# EAGLE schematic Protocell_module (EAGLE 7.1.0)
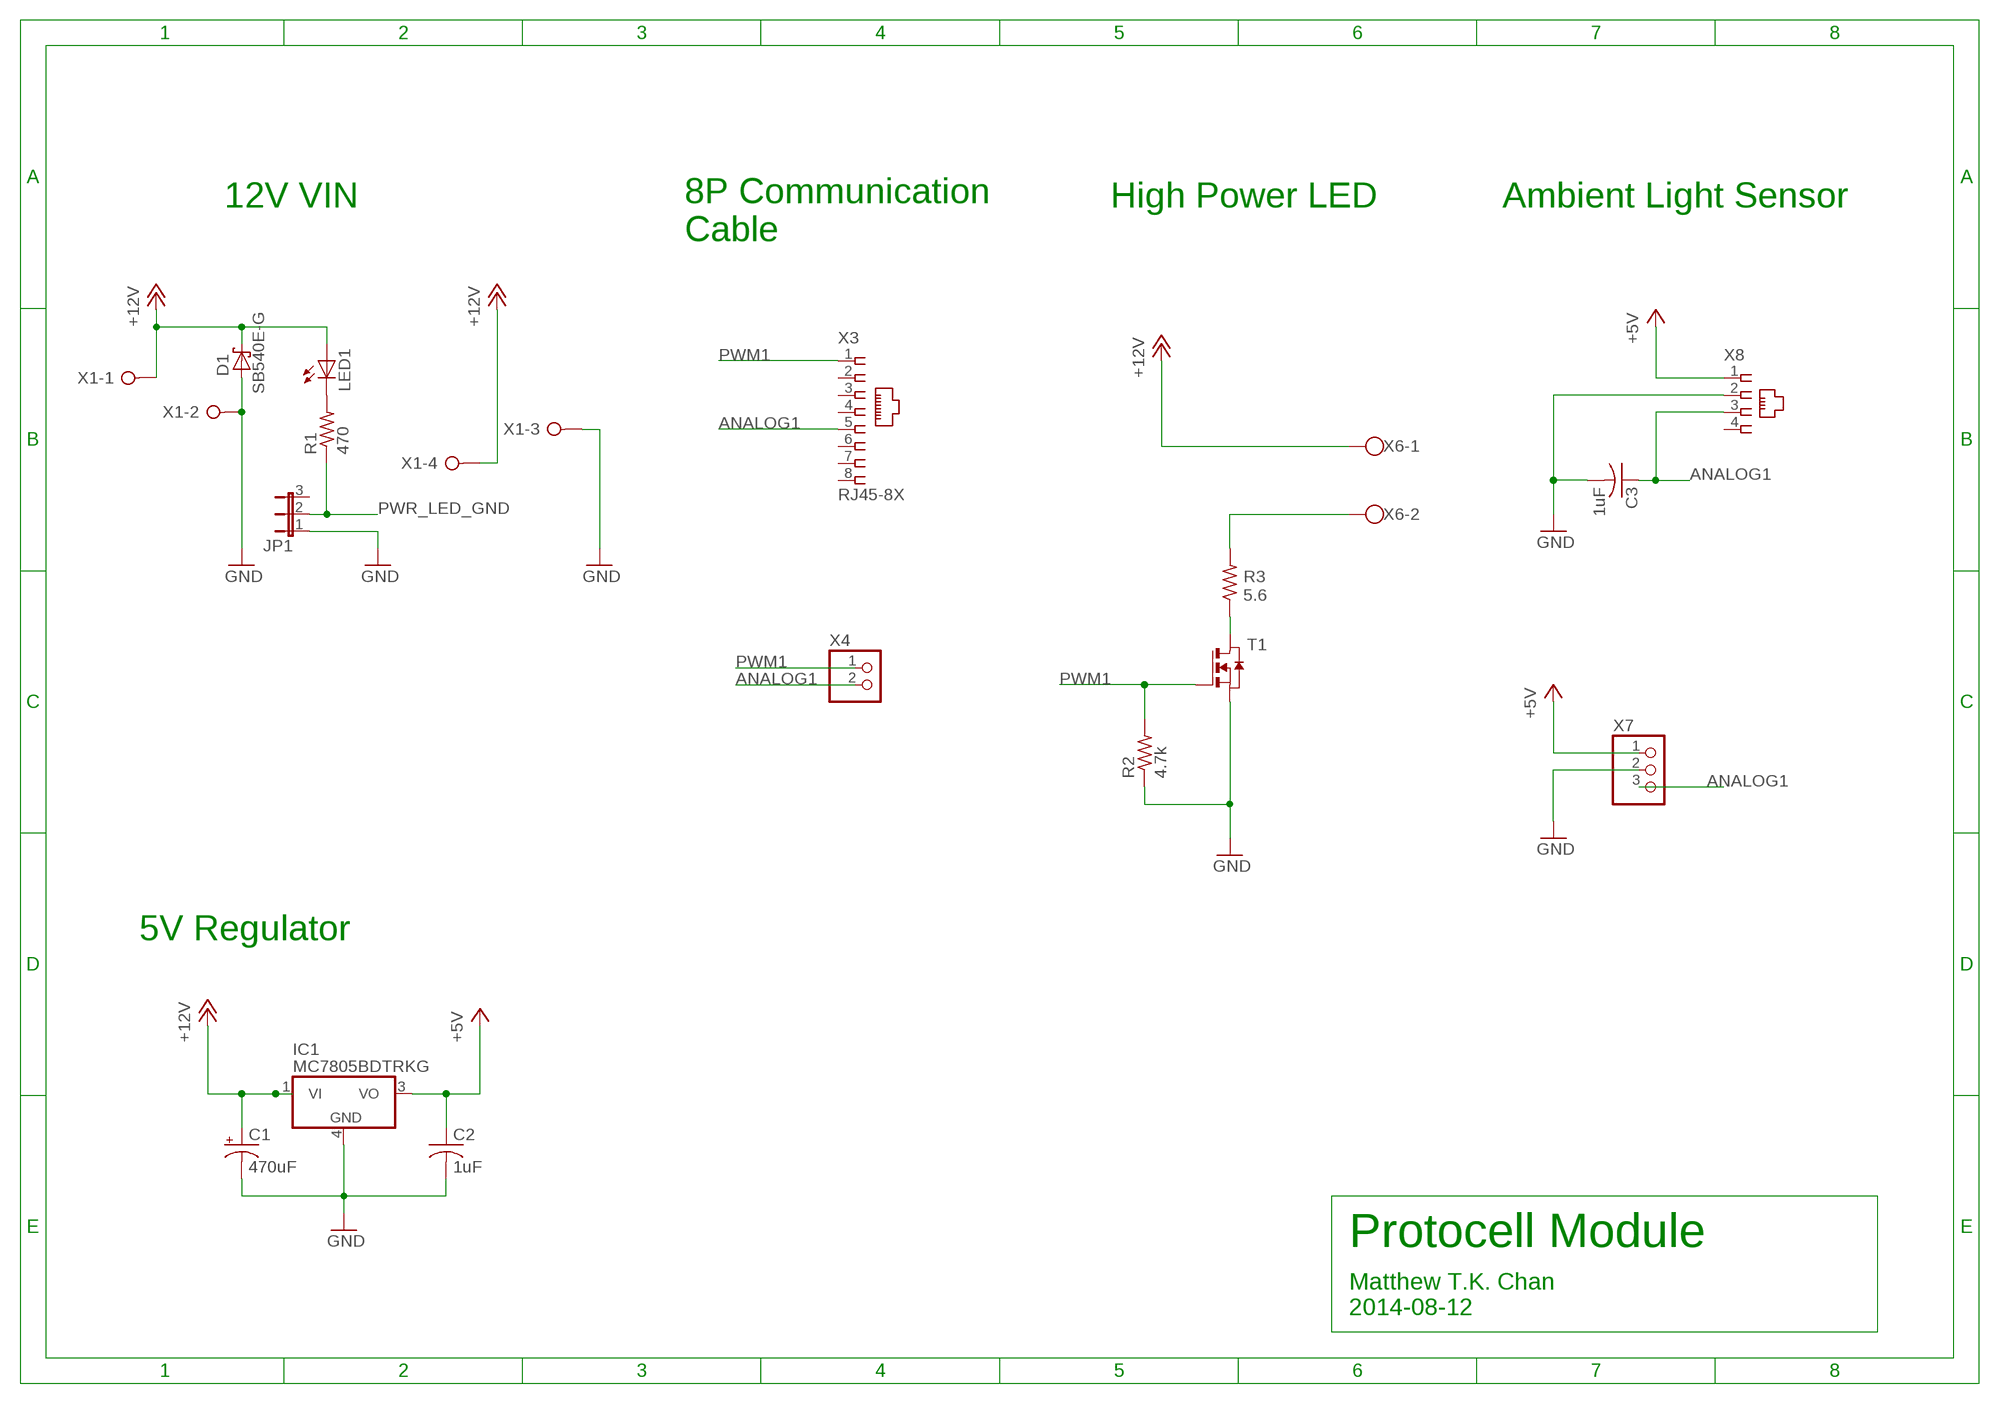
[diagram p0: schematic, sheet 1]

## Parts
C1  470uF  CPOL-USE5-10.5  [E5-10,5]
C2  1uF  C-USC0603  [C0603]
C3  1uF  C-USC0603  [C0603]
D1  SB540E-G  [DO201T15]
IC1  MC7805BDTRKG  [DPACK_3]
JP1  JP2E  [JP2]
LED1  LEDSML1206  [SML1206]
R1  470  R-US_R0603  [R0603]
R2  4.7k  R-US_R0603  [R0603]
R3  5.6  SQP500JB-5R6  [YAGEO_SQP500JB]
T1  NTD5867NLT4G  [DPACK]
X1  W237-04P  [W237-4P]
X3  RJ45-8X  [RJ45-NO-SHIELD]
X4  PINHD-1X2  [1X02]
X6  W237-102  [W237-102]
X7  PINHD-1X3  [1X03]
X8  558872-1  [558872-1]

## Nets
+5V: C2.1 IC1.3(VO) X7.1 X8.1
+12V: C1.+ D1.C IC1.1(VI) LED1.A X1.1 X1.4 X6.1
ANALOG1: C3.1 X3.5 X4.2 X7.3 X8.3
GND: C1.- C2.2 C3.2 D1.A IC1.4(GND) JP1.1 R2.1 T1.3(S) X1.2 X1.3 X7.2 X8.2
N$1: R3.1 T1.2(D)
N$3: R3.2 X6.2
N$10: LED1.C R1.2
PWM1: R2.2 T1.1(G) X3.1 X4.1
PWR_LED_GND: JP1.2 R1.1
Unconnected: JP1.3 X3.2 X3.3 X3.4 X3.6 X3.7 X3.8 X8.4

## Notes on the sheet
- 12V VIN | High Power LED | Ambient Light Sensor
- 8P Communication 
  Cable
- 5V Regulator
- Protocell Module
- Matthew T.K. Chan
  2014-08-12

## Library data of the parts
C1 = rcl:CPOL-US: POLARIZED CAPACITOR, American symbol
C2 C3 = rcl:C-US: CAPACITOR, American symbol
D1 = CBLA_Test_bed_Library:SB540E-G: SCHOTTKY BARRIER RECTIFIER 3.0 AMPERES 20, 30, 40 VOLT Source: MBRS340T3-D.pdf
IC1 = CBLA_Test_bed_Library:MC78: 1A Positive Voltage Regulators Source: Data sheet <http://www.onsemi.com/pub_link/Collateral/MC7800-D.PDF>
JP1 = jumper:JP2E: JUMPER
LED1 = led:LED: LED OSRAM: - CHIPLED LG R971, LG N971, LY N971, LG Q971, LY Q971, LO R971, LY R971 LH N974, LH R974 LS Q976, LO Q976, LY Q976 LO Q996 - Hyper CHIPLED LW Q18S LB Q993, LB Q99A, LB R99A - SideLED LS A670, LO A670, LY A670, LG A670, LP A670 LB A673, LV A673, LT A673, LW A673 LH A674 LY A675 LS A676, LA A676, LO A676, LY A676, LW A676 LS A679, LY A679, LG A679 - Hyper Micro SIDELED® LS Y876, LA Y876, LO Y876, LY Y876 LT Y87S - SmartLED LW L88C, LW L88S LB L89C, LB L89S, LG L890 LS L89K, LO L89K, LY L89K LS L896, LA L896, LO L896, LY L896 - TOPLED LS T670, LO T670, LY T670, LG T670, LP T670 LSG T670, LSP T670, LSY T670, LOP T670, LYG T670 LG T671, LOG T671, LSG T671 LB T673, LV T673, LT T673, LW T673 LH T674 LS T676, LA T676, LO T676, LY T676, LB T676, LH T676, LSB T676, LW T676 LB T67C, LV T67C, LT T67C, LS T67K, LO T67K, LY T67K, LW E67C LS E67B, LA E67B, LO E67B, LY E67B, LB E67C, LV E67C, LT E67C LW T67C LS T679, LY T679, LG T679 LS T770, LO T770, LY T770, LG T770, LP T770 LB T773, LV T773, LT T773, LW T773 LH T774 LS E675, LA E675, LY E675, LS T675 LS T776, LA T776, LO T776, LY T776, LB T776 LHGB T686 LT T68C, LB T68C - Hyper Mini TOPLED® LB M676 - Mini TOPLED Santana® LG M470 LS M47K, LO M47K, LY M47K Source: http://www.osram.convergy.de LUXEON: - LUMILED® LXK2-PW12-R00, LXK2-PW12-S00, LXK2-PW14-U00, LXK2-PW14-V00 LXK2-PM12-R00, LXK2-PM12-S00, LXK2-PM14-U00 LXK2-PE12-Q00, LXK2-PE12-R00, LXK2-PE12-S00, LXK2-PE14-T00, LXK2-PE14-U00 LXK2-PB12-K00, LXK2-PB12-L00, LXK2-PB12-M00, LXK2-PB14-N00, LXK2-PB14-P00, LXK2-PB14-Q00 LXK2-PR12-L00, LXK2-PR12-M00, LXK2-PR14-Q00, LXK2-PR14-R00 LXK2-PD12-Q00, LXK2-PD12-R00, LXK2-PD12-S00 LXK2-PH12-R00, LXK2-PH12-S00 LXK2-PL12-P00, LXK2-PL12-Q00, LXK2-PL12-R00 Source: www.luxeon.com KINGBRIGHT: KA-3528ASYC Source: www.kingbright.com
R1 R2 = CBLA_Test_bed_Library:R-US_: RESISTOR, American symbol
R3 = CBLA_Test_bed_Library:SQP500
T1 = CBLA_Test_bed_Library:NTD5867NL: MOS FET
X1 = con-wago-508:W237-04P: WAGO SREW CLAMP; OC_FARNELL: unknown; OC_NEWARK: unknown
X3 = CBLA_Test_bed_Library:RJ45: CORCOM Modular RJ Jacks No Shield Source: www.tycoelectronics.com .. ENG_DS_1654001_1099_RJ_L_0507.pdf; MPN: RJ45-8X; OC_FARNELL: unknown; OC_NEWARK: 16R6101
X4 = CBLA_Test_bed_Library:PINHD-1X2: PIN HEADER
X6 = con-wago-500:W237-102: WAGO SCREW CLAMP; MPN: 237-102; OC_FARNELL: unknown; OC_NEWARK: 70K9898
X7 = CBLA_Test_bed_Library:PINHD-1X3: PIN HEADER
X8 = CBLA_Test_bed_Library:558872-1: AMP connector; MF: TYCO ELECTRONICS; MPN: 5558872-1; OC_FARNELL: 1557674; OC_NEWARK: 42K7312